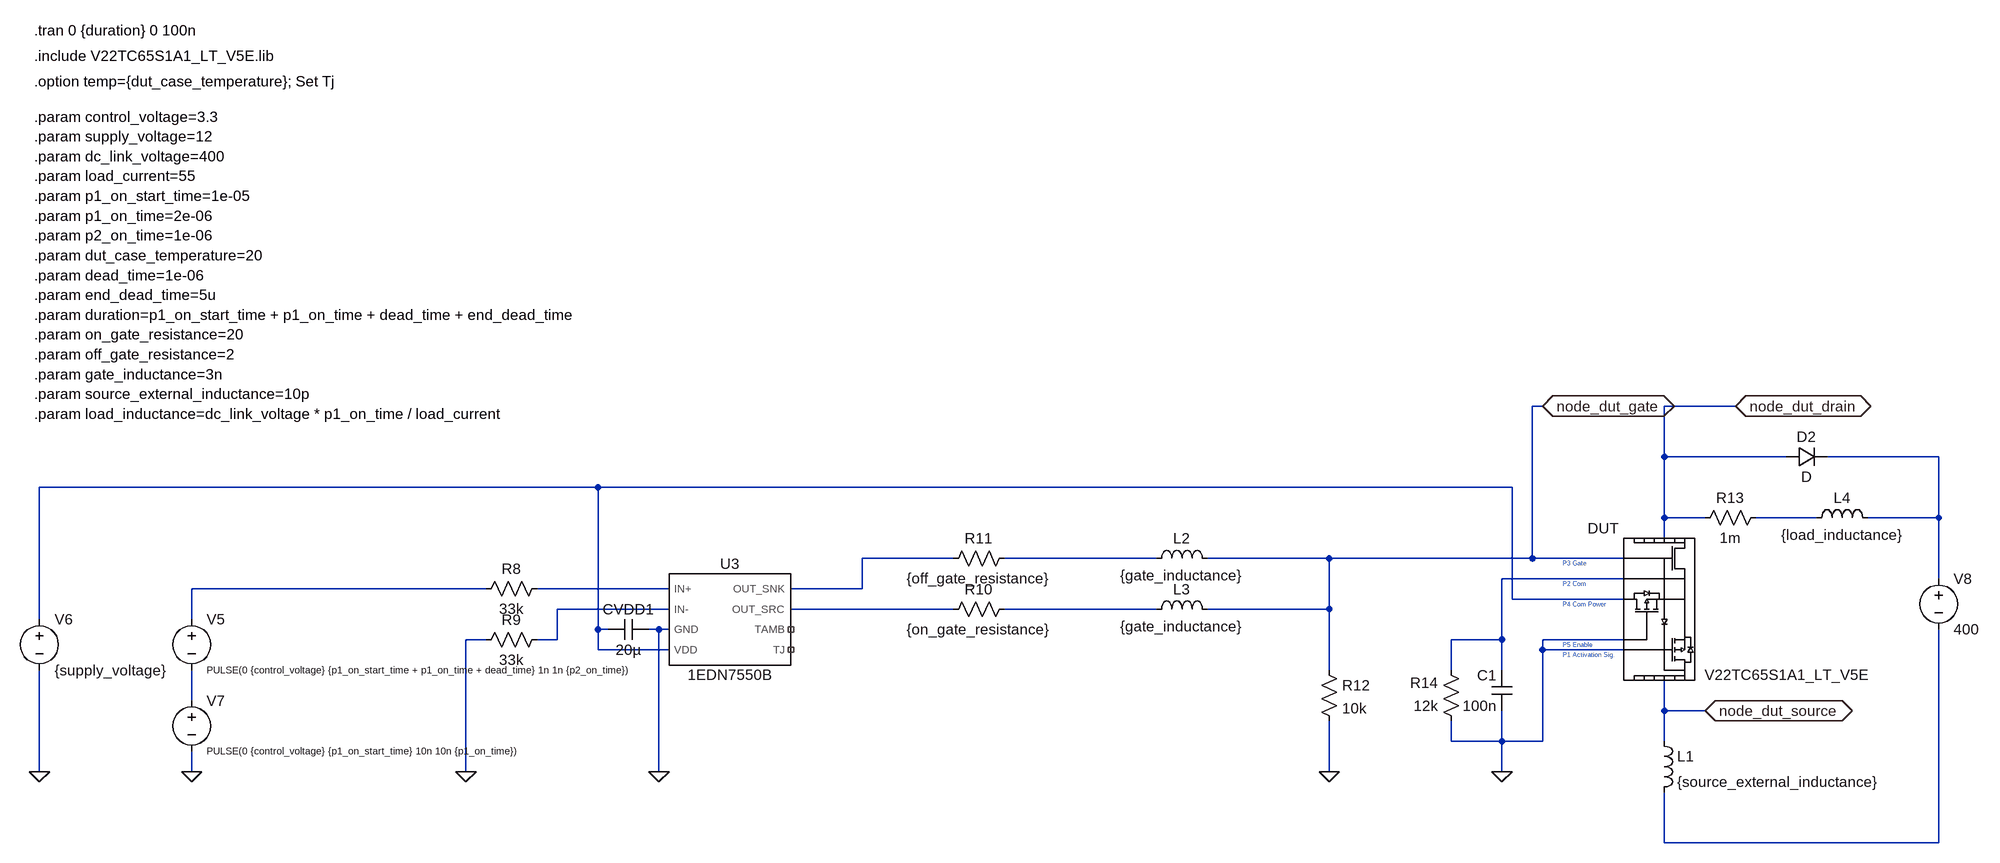
[diagram p0: schematic temp_double_pulse_test_gan_v22tc65s1a1.asc]
temp_double_pulse_test_gan_v22tc65s1a1.asc, the LTspice schematic file:
Version 4
SHEET 1 984 772
WIRE -736 -848 -752 -848
WIRE -432 -848 -544 -848
WIRE -544 -768 -544 -848
WIRE -352 -768 -544 -768
WIRE -112 -768 -288 -768
WIRE -2224 -720 -3104 -720
WIRE -784 -720 -2224 -720
WIRE -544 -672 -544 -768
WIRE -480 -672 -544 -672
WIRE -304 -672 -400 -672
WIRE -112 -672 -112 -768
WIRE -112 -672 -224 -672
WIRE -544 -640 -544 -672
WIRE -1664 -608 -1808 -608
WIRE -1344 -608 -1584 -608
WIRE -1072 -608 -1264 -608
WIRE -752 -608 -752 -848
WIRE -752 -608 -1072 -608
WIRE -608 -608 -752 -608
WIRE -608 -576 -800 -576
WIRE -112 -576 -112 -672
WIRE -2400 -560 -2864 -560
WIRE -2112 -560 -2320 -560
WIRE -1808 -560 -1808 -608
WIRE -1808 -560 -1920 -560
WIRE -784 -544 -784 -720
WIRE -608 -544 -784 -544
WIRE -2112 -528 -2288 -528
WIRE -1664 -528 -1920 -528
WIRE -1344 -528 -1584 -528
WIRE -1072 -528 -1072 -608
WIRE -1072 -528 -1264 -528
WIRE -3104 -512 -3104 -720
WIRE -2864 -512 -2864 -560
WIRE -2224 -496 -2224 -720
WIRE -2208 -496 -2224 -496
WIRE -2128 -496 -2144 -496
WIRE -2112 -496 -2128 -496
WIRE -2400 -480 -2432 -480
WIRE -2288 -480 -2288 -528
WIRE -2288 -480 -2320 -480
WIRE -800 -480 -800 -576
WIRE -800 -480 -880 -480
WIRE -608 -480 -736 -480
WIRE -2224 -464 -2224 -496
WIRE -2112 -464 -2224 -464
WIRE -736 -464 -736 -480
WIRE -608 -464 -736 -464
WIRE -1072 -432 -1072 -528
WIRE -880 -432 -880 -480
WIRE -800 -432 -800 -480
WIRE -2864 -384 -2864 -432
WIRE -544 -368 -544 -416
WIRE -480 -368 -544 -368
WIRE -880 -320 -880 -352
WIRE -800 -320 -800 -368
WIRE -800 -320 -880 -320
WIRE -736 -320 -736 -464
WIRE -736 -320 -800 -320
WIRE -544 -320 -544 -368
WIRE -3104 -272 -3104 -432
WIRE -2864 -272 -2864 -304
WIRE -2432 -272 -2432 -480
WIRE -2128 -272 -2128 -496
WIRE -1072 -272 -1072 -352
WIRE -800 -272 -800 -320
WIRE -544 -160 -544 -240
WIRE -112 -160 -112 -496
WIRE -112 -160 -544 -160
FLAG -2432 -272 0
FLAG -2864 -272 0
FLAG -3104 -272 0
FLAG -2128 -272 0
FLAG -1072 -272 0
FLAG -800 -272 0
FLAG -480 -368 node_dut_source
IOPIN -480 -368 BiDir
FLAG -432 -848 node_dut_drain
IOPIN -432 -848 BiDir
FLAG -736 -848 node_dut_gate
IOPIN -736 -848 BiDir
SYMBOL 1EDN7550B -2016 -512 R0
SYMATTR InstName U3
SYMBOL res -2304 -576 R90
WINDOW 0 0 56 VBottom 2
WINDOW 3 32 56 VTop 2
SYMATTR InstName R8
SYMATTR Value 33k
SYMBOL res -2304 -496 R90
WINDOW 0 0 56 VBottom 2
WINDOW 3 32 56 VTop 2
SYMATTR InstName R9
SYMATTR Value 33k
SYMBOL voltage -2864 -528 R0
WINDOW 123 0 0 Left 0
WINDOW 39 0 0 Left 0
WINDOW 3 24 96 Left 1
SYMATTR Value PULSE(0 {control_voltage} {p1_on_start_time + p1_on_time + dead_time} 1n 1n {p2_on_time})
SYMATTR InstName V5
SYMBOL cap -2144 -512 R90
WINDOW 0 0 32 VBottom 2
WINDOW 3 32 32 VTop 2
SYMATTR InstName CVDD1
SYMATTR Value 20µ
SYMBOL voltage -3104 -528 R0
WINDOW 123 0 0 Left 0
WINDOW 39 0 0 Left 0
SYMATTR InstName V6
SYMATTR Value {supply_voltage}
SYMBOL res -1568 -544 R90
WINDOW 0 0 56 VBottom 2
WINDOW 3 32 56 VTop 2
SYMATTR InstName R10
SYMATTR Value {on_gate_resistance}
SYMBOL res -1568 -624 R90
WINDOW 0 0 56 VBottom 2
WINDOW 3 32 56 VTop 2
SYMATTR InstName R11
SYMATTR Value {off_gate_resistance}
SYMBOL ind -1360 -592 R270
WINDOW 0 32 56 VTop 2
WINDOW 3 5 56 VBottom 2
SYMATTR InstName L2
SYMATTR Value {gate_inductance}
SYMBOL ind -1360 -512 R270
WINDOW 0 32 56 VTop 2
WINDOW 3 5 56 VBottom 2
SYMATTR InstName L3
SYMATTR Value {gate_inductance}
SYMBOL voltage -2864 -400 R0
WINDOW 123 0 0 Left 0
WINDOW 39 0 0 Left 0
WINDOW 3 24 96 Left 1
SYMATTR Value PULSE(0 {control_voltage} {p1_on_start_time} 10n 10n {p1_on_time})
SYMATTR InstName V7
SYMBOL res -1088 -448 R0
SYMATTR InstName R12
SYMATTR Value 10k
SYMBOL V22TC65S1A1_LT_V5E -544 -544 R0
WINDOW 3 194 104 Top 2
SYMATTR InstName DUT
SYMBOL voltage -112 -592 R0
WINDOW 123 0 0 Left 0
WINDOW 39 0 0 Left 0
SYMATTR InstName V8
SYMATTR Value 400
SYMBOL diode -352 -752 R270
WINDOW 0 32 32 VTop 2
WINDOW 3 0 32 VBottom 2
SYMATTR InstName D2
SYMBOL res -384 -688 R90
WINDOW 0 0 56 VBottom 2
WINDOW 3 32 56 VTop 2
SYMATTR InstName R13
SYMATTR Value 1m
SYMBOL ind -320 -656 R270
WINDOW 0 32 56 VTop 2
WINDOW 3 5 56 VBottom 2
SYMATTR InstName L4
SYMATTR Value {load_inductance}
SYMBOL cap -784 -368 R180
WINDOW 0 24 56 Left 2
WINDOW 3 24 8 Left 2
SYMATTR InstName C1
SYMATTR Value 100n
SYMBOL res -864 -336 R180
WINDOW 0 36 76 Left 2
WINDOW 3 36 40 Left 2
SYMATTR InstName R14
SYMATTR Value 12k
SYMBOL ind -560 -336 R0
SYMATTR InstName L1
SYMATTR Value {source_external_inductance}
TEXT -3112 -1440 Left 2 !.tran 0 {duration} 0 100n
TEXT -3112 -1360 Left 2 !.option temp={dut_case_temperature}; Set Tj
TEXT -3112 -1304 Left 2 !.param control_voltage=3.3\n.param supply_voltage=12\n.param dc_link_voltage=400\n.param load_current=55\n.param p1_on_start_time=1e-05\n.param p1_on_time=2e-06\n.param p2_on_time=1e-06\n.param dut_case_temperature=20\n.param dead_time=1e-06\n.param end_dead_time=5u\n.param duration=p1_on_start_time + p1_on_time + dead_time + end_dead_time\n.param on_gate_resistance=20\n.param off_gate_resistance=2 \n.param gate_inductance=3n \n.param source_external_inductance=10p \n.param load_inductance=dc_link_voltage * p1_on_time / load_current
TEXT -704 -536 Left 0 ;P4 Com Power
TEXT -704 -568 Left 0 ;P2 Com
TEXT -704 -600 Left 0 ;P3 Gate
TEXT -704 -472 Left 0 ;P5 Enable
TEXT -704 -456 Left 0 ;P1 Activation Sig.
TEXT -3112 -1400 Left 2 !.include V22TC65S1A1_LT_V5E.lib

The netlist it stands for:
* temp_double_pulse_test_gan_v22tc65s1a1.asc
XU3 N008 N009 0 N002 N004 N010 NC_01 NC_02 1EDN7550B  ; pins IN+ IN- GND VDD OUT_SNK OUT_SRC TAMB TJ
R8 N008 N007 33k
R9 N009 0 33k
V5 N007 N012 PULSE(0 {control_voltage} {p1_on_start_time + p1_on_time + dead_time} 1n 1n {p2_on_time})
CVDD1 0 N002 20µ
V6 N002 0 {supply_voltage}
R10 N011 N010 {on_gate_resistance}
R11 N005 N004 {off_gate_resistance}
L2 N005 node_dut_gate {gate_inductance}
L3 N011 node_dut_gate {gate_inductance}
V7 N012 0 PULSE(0 {control_voltage} {p1_on_start_time} 10n 10n {p1_on_time})
R12 node_dut_gate 0 10k
XDUT 0 N006 node_dut_gate N002 0 node_dut_drain node_dut_source V22TC65S1A1_LT_V5E  ; pins As Cs G Cp En D S
V8 N001 N013 400
D2 node_dut_drain N001 D
R13 N003 node_dut_drain 1m
L4 N003 N001 {load_inductance}
C1 0 N006 100n
R14 0 N006 12k
L1 node_dut_source N013 {source_external_inductance}
.model D D
.lib standard.dio
.tran 0 {duration} 0 100n
.option temp={dut_case_temperature}; Set Tj
.param control_voltage=3.3
.param supply_voltage=12
.param dc_link_voltage=400
.param load_current=55
.param p1_on_start_time=1e-05
.param p1_on_time=2e-06
.param p2_on_time=1e-06
.param dut_case_temperature=20
.param dead_time=1e-06
.param end_dead_time=5u
.param duration=p1_on_start_time + p1_on_time + dead_time + end_dead_time
.param on_gate_resistance=20
.param off_gate_resistance=2
.param gate_inductance=3n
.param source_external_inductance=10p
.param load_inductance=dc_link_voltage * p1_on_time / load_current
* P4 Com Power
* P2 Com
* P3 Gate
* P5 Enable
* P1 Activation Sig.
.include V22TC65S1A1_LT_V5E.lib
.lib C:\Users\joshu\OneDrive - Stellenbosch University\Obsidian\Postgraduate Vault\Areas\RU Electronics and Drives\Resources\Spice Models\Infineon-Non_isolated_Gate_Driver_IC_1EDN7550B_Spice-SimulationModels-v01_00-EN\Model\1EDN7550B.lib
.lib V22TC65S1A1_LT_V5E.lib
.backanno
.end